# Altium schematic sheet Termistor input.SchDoc
size A4; SheetNumber: 8; SheetTotal: 11
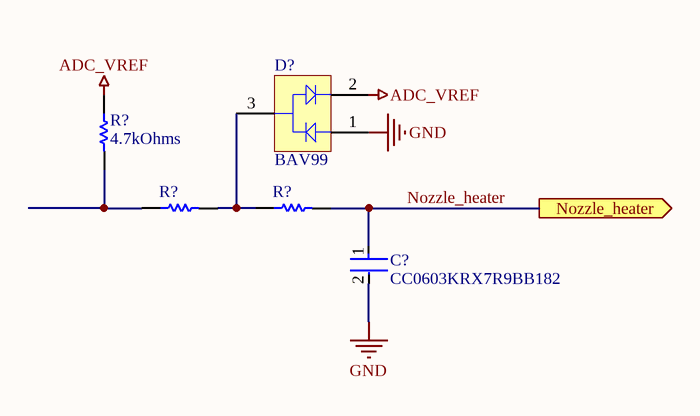
[diagram p0: Termistor input.SchDoc]

## Parts
(Parts that share a designator on the sheet are numbered #1, #2 ... from top to bottom, then left to right.)
C?  CC0603KRX7R9BB182  [FP-CC0603-DA-MFG]
D?  BAV99  [INF-SOT23_N]
R?#1  Resistance: 4.7kOhms  [RESC1608X55X25ML10T15]  (hidden comment: RC0603JR-074K7L)
R?#2  RC0603JR-07510RL  [RESC1608X55X25LL10T15]  (value not drawn)
R?#3  RK73H1JTTD2371F  [RESC1608X55X30NL20T10]  (value not drawn)

## Ports
Nozzle_heater (out)

## Nets
ADC_VREF: D?.2(K2) R?#1.1
GND: C?.2 D?.1(A1)
Nozzle_heater: C?.1 R?#3.2 ; port Nozzle_heater
NetD?_3: D?.3(C) R?#2.2 R?#3.1
NetR?#1_2: R?#1.2 R?#2.1

## Library data of the parts
C? = CMP-03422-000899-1: CAP CER 1800PF 50V X7R 0603; Manufacturer: YAGEO; Description: CC0603 1.8 nF X7R 10.00% 50 V; Value: 1.8 nF; Temperature Coefficient: 15%; Material: Ceramic; Tolerance: 0.1; Category: Cap; Digikey Description: CAP CER 1800PF 50V X7R 0603; Temperature Range High: +125°C; Voltage: 50 V; Mouser Description: 0603 1.8 nF 50 V ±10 % Tolerance X7R SMT Multilayer Ceramic Capacitor; Temperature: -55°C to +125°C; Device Class L2: Capacitors; Automotive: No; Octopart: https://octopart.com/cc0603krx7r9bb182-yageo-42335658; Package: CC0603-DA; ComponentLink2URL: http://www.yageo.com/documents/recent/UPY-GPHC_X7R_6.3V-to-50V_18.pdf; Manufacturer Part Number: CC0603KRX7R9BB182; RoHS: TRUE; Footprint Url: http://www.yageo.com/exep/pages/download/literatures/UPY-C_GEN_24.pdf; Lead Free: Yes; Height: 0.9mm; Voltage Rating: 50 V; Temperature Characteristic: X7R; Temperature Range Low: -55°C; Capacitance: 1.8 nF; Device Class L1: Passive Components; ComponentLink2Description: Datasheet; Device Class L3: Ceramic Capacitors
D? = CMP-1176-00014-1: Silicon Switching Diode, SOT23, Reel, Green; Manufacturer: Infineon; Green: TRUE; Mounting Technology: Surface Mount; ComponentLink3URL: http://www.infineon.com/dgdl/smbta14_mmbta14.pdf?folderId=db3a30431441fb5d011445c30f210183&fileId=db3a30431441fb5d011445ef0201018c; PartNumber: BAV99; ComponentLink2Description: Datasheet; ComponentLink2URL: http://www.infineon.com/dgdl/bav99series.pdf?folderId=db3a30431400ef6801141b5844e103ea&fileId=db3a30431400ef6801141c1b237d042f; PackageVersion: Apr-08; PackageDescription: 3-Pin Small Outline Transistor Package, 1.3 x 2.9 mm Body, 0.95 mm Pitch; RevisionNote: Re-Activated Devices; ComponentLink1URL: http://www.infineon.com/; PackageReference: SOT23; ComponentLink1Description: Manufacturer URL; ComponentLink3Description: Package Specification; Packing: Reel
R?#1 = CMP-2000-05024-1: Chip Resistor, 4.7 KOhm, +/- 5%, 100 mW, -55 to 155 degC, 0603 (1608 Metric), RoHS, Tape and Reel; Manufacturer: Yageo; Temperature Coefficient: 100PPM/C; Power Rating: 100mW; Voltage Rating: 50V; Operating Temperature Range: -55Cto+155C; Case Code - mm: 1608; Tolerance: 5%; Product: ThickFilmResistorsGeneralPurpose; Case Code - in: 0603; Datasheet URL: http://www.yageo.com/documents/recent/PYu-RC_Group_51_RoHS_L_04.pdf; Package Reference: 603; Datasheet Version: Rev. 4, 02/2016; Package Description: 2-Pin Surface Mount Device, Body 1.6 x 0.8 mm; Manufacturer URL: http://www.yageo.com/; Series: RC; Packaging: Reel; Termination Style: SMD/SMT
R?#2 = CMP-2000-04281-1: Manufacturer: Yageo; Part Number: RC0603JR-07510RL
R?#3 = CMP-2000-01325-1: Manufacturer: KOA Speer; Part Number: RK73H1JTTD2371F